# Altium schematic sheet TXS0102_I2C_Bus_Voltage_Translator.SchDoc: I2C Bus Buffer - Voltage Translator
size A4
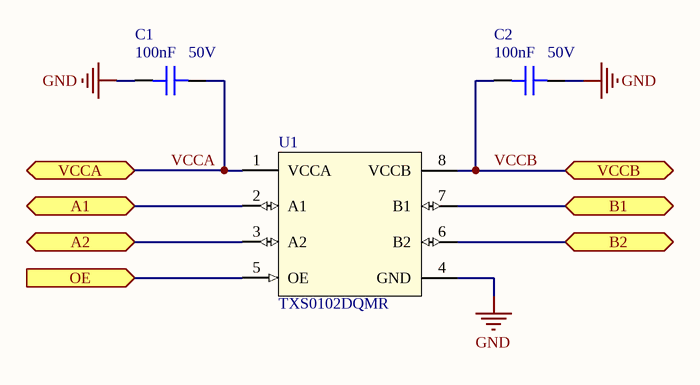
[diagram p0: TXS0102_I2C_Bus_Voltage_Translator.SchDoc]

## Parts
C1  Capacitance: 100nF  Voltage: 50V  [C0402]  (hidden comment: CGA2B3X7R1H104K050BB)
C2  Capacitance: 100nF  Voltage: 50V  [C0402]  (hidden comment: CGA2B3X7R1H104K050BB)
U1  TXS0102DQMR  [DQM8]

## Ports
A1 (bidir), A2 (bidir), B1 (bidir), B2 (bidir), OE (in), VCCA, VCCB

## Nets
GND: C1.2 C2.1 U1.4(GND)
A1: U1.2(A1) ; port A1
A2: U1.3(A2) ; port A2
B1: U1.7(B1) ; port B1
B2: U1.6(B2) ; port B2
OE: U1.5(OE) ; port OE
VCCA: C1.1 U1.1(VCCA) ; port VCCA
VCCB: C2.2 U1.8(VCCB) ; port VCCB

## Notes on the sheet
- Title
- Size:
- Date:
- A4
- Number:
- Time:
- Revision:
- Sheet
- of
- File:

## Library data of the parts
C1 C2 = CAP CER 0.1UF 50V X7R 0402: 0.1µF ±10% 50V Ceramic Capacitor X7R 0402 (1005 Metric); Manufacturer: TDK; Manufacturer Part Number: CGA2B3X7R1H104K050BB; Supplier 1: Digi-Key; Stock 1: 2925303; Pricing 1: 1=0.17, 10=0.118, 50=0.0668, 100=0.0553, 500=0.0388, 1000=0.0321, 2500=0.0299, 5000=0.0273 (USD); Mount: Surface Mount; Case Code (Metric): 1005; Case Code (Imperial): 0402; Min Operating Temperature: -55°C; Max Operating Temperature: 125°C; Tolerance: 10%; Dielectric: X7R; Voltage Rating: 50V; Voltage Rating (DC): 50V; Packaging: Tape and Reel; Package Quantity: 1; Termination: SMD/SMT; Composition: Ceramic; Length: 1mm; Height: 0.5mm; Width: 0.02inch; Thickness: 0.022inch; Depth: 0.5mm; REACH SVHC: No SVHC; Lead Free: Lead Free; ComponentLink1URL: http://product.tdk.com/capacitor/mlcc/en/documents/mlccspec_automotive_general_midvoltage_en.pdf?src-supplier=Future+Electronics; ComponentLink1Description: http://product.tdk.com/capacitor/mlcc/en/documents/mlccspec_automotive_general_midvoltage_en.pdf?src-supplier=Future+Electronics; ComponentLink2URL: http://www.farnell.com/datasheets/1807242.pdf?src-supplier=Element14; ComponentLink2Description: http://www.farnell.com/datasheets/1807242.pdf?src-supplier=Element14; ComponentLink3URL: http://www.mouser.com/ds/2/400/lcc_automotive_general_en-843974.pdf?src-supplier=Mouser; ComponentLink3Description: http://www.mouser.com/ds/2/400/lcc_automotive_general_en-843974.pdf?src-supplier=Mouser; ComponentLink4URL: http://www.farnell.com/datasheets/1936565.pdf?src-supplier=Element14; ComponentLink4Description: http://www.farnell.com/datasheets/1936565.pdf?src-supplier=Element14; ComponentLink5URL: http://www.farnell.com/datasheets/1735392.pdf?src-supplier=Element14; ComponentLink5Description: http://www.farnell.com/datasheets/1735392.pdf?src-supplier=Element14; Supplier Part Number 1: 445-6899-1-ND; Case/Package: 0402; Weight: 2.3E-05oz; Ratings: AEC-Q200
U1 = IC TXS0102 TRNSLTR BIDIRECTIONAL 8X2SON: 2-Bit Bidirectional Voltage-Level Translator for Open-Drain Application; Manufacturer: Texas Instruments; Max Supply Voltage: 5.5V; Min Supply Voltage: 1.65V; Propagation Delay: 260ns; Data Rate: 24Mbps; Number of Channels: 2; Turn-On Delay Time: 4.6ns; Low Level Output Current: 1mA; High Level Output Current: -20uA; Quiescent Current: 14.4uA; Supplier 1: Digi-Key; Manufacturer Part Number: TXS0102DQMR; Stock 1: 53273; Pricing 1: 1=0.69, 10=0.611, 25=0.5736, 100=0.4681, 250=0.4348, 500=0.37, 1000=0.296 (USD); Mount: Surface Mount; Number of Pins: 8; Contact Plating: Gold; Min Operating Temperature: -40°C; Max Operating Temperature: 85°C; Packaging: Tape and Reel; Package Quantity: 1; Logic Function: Translator; Number of Bits: 2; Number of Inputs: 2; Output Type: Voltage; Length: 1.85mm; Height: 0.35mm; Width: 1.25mm; Radiation Hardening: No; REACH SVHC: No SVHC; Lead Free: Lead Free; ComponentLink1URL: https://www.verical.com/server-webapp/html/getDatasheet?partID=544149&src-supplier=Verical; ComponentLink1Description: https://www.verical.com/server-webapp/html/getDatasheet?partID=544149&src-supplier=Verical; ComponentLink2URL: http://www.ti.com/general/docs/suppproductinfo.tsp?distId=10&gotoUrl=http%3A%2F%2Fwww.ti.com%2Flit%2Fgpn%2Ftxs0102&src-supplier=Digi-Key; ComponentLink2Description: http://www.ti.com/general/docs/suppproductinfo.tsp?distId=10&gotoUrl=http%3A%2F%2Fwww.ti.com%2Flit%2Fgpn%2Ftxs0102&src-supplier=Digi-Key; Supplier Part Number 1: 296-28435-1-ND